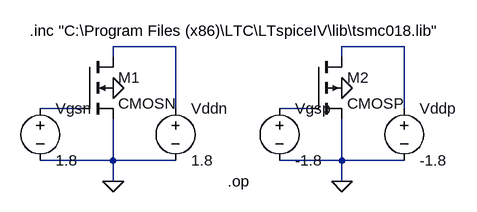
[diagram p0: schematic mos.asc]
mos.asc, the LTspice schematic file:
Version 4
SHEET 1 880 680
WIRE 128 64 32 64
WIRE 480 64 384 64
WIRE 32 80 32 64
WIRE 384 80 384 64
WIRE -16 160 -80 160
WIRE 128 160 128 64
WIRE 336 160 288 160
WIRE 480 160 480 64
WIRE 32 240 32 176
WIRE 32 240 -80 240
WIRE 128 240 32 240
WIRE 384 240 384 176
WIRE 384 240 288 240
WIRE 480 240 384 240
WIRE 32 272 32 240
WIRE 384 272 384 240
FLAG 32 128 0
FLAG 384 128 0
FLAG 32 272 0
FLAG 384 272 0
SYMBOL cmosn -16 80 R0
SYMATTR InstName M1
SYMATTR Value2 l=180n w=360n
SYMBOL cmosp 336 80 R0
SYMATTR InstName M2
SYMATTR Value2 l=180n w=360n
SYMBOL voltage 128 144 R0
WINDOW 123 0 0 Left 2
WINDOW 39 0 0 Left 2
SYMATTR InstName Vddn
SYMATTR Value 1.8
SYMBOL voltage 480 144 R0
WINDOW 123 0 0 Left 2
WINDOW 39 0 0 Left 2
SYMATTR InstName Vddp
SYMATTR Value -1.8
SYMBOL voltage -80 144 R0
WINDOW 123 0 0 Left 2
WINDOW 39 0 0 Left 2
SYMATTR InstName Vgsn
SYMATTR Value 1.8
SYMBOL voltage 288 144 R0
WINDOW 123 0 0 Left 2
WINDOW 39 0 0 Left 2
SYMATTR InstName Vgsp
SYMATTR Value -1.8
TEXT 208 272 Left 2 !.op
TEXT -96 40 Left 2 !.inc "C:\\Program Files (x86)\\LTC\\LTspiceIV\\lib\\tsmc018.lib"

The netlist it stands for:
* mos.asc
M1 N001 N003 0 0 CMOSN l=180n w=360n
M2 N002 N004 0 0 CMOSP l=180n w=360n
Vddn N001 0 1.8
Vddp N002 0 -1.8
Vgsn N003 0 1.8
Vgsp N004 0 -1.8
.model NMOS NMOS
.model PMOS PMOS
.lib standard.mos
.op
.inc "C:\Program Files (x86)\LTC\LTspiceIV\lib\tsmc018.lib"
.backanno
.end